# EAGLE design norns-shield-CS4271 (EAGLE 9.6.2)

## Sheet 1 of 2
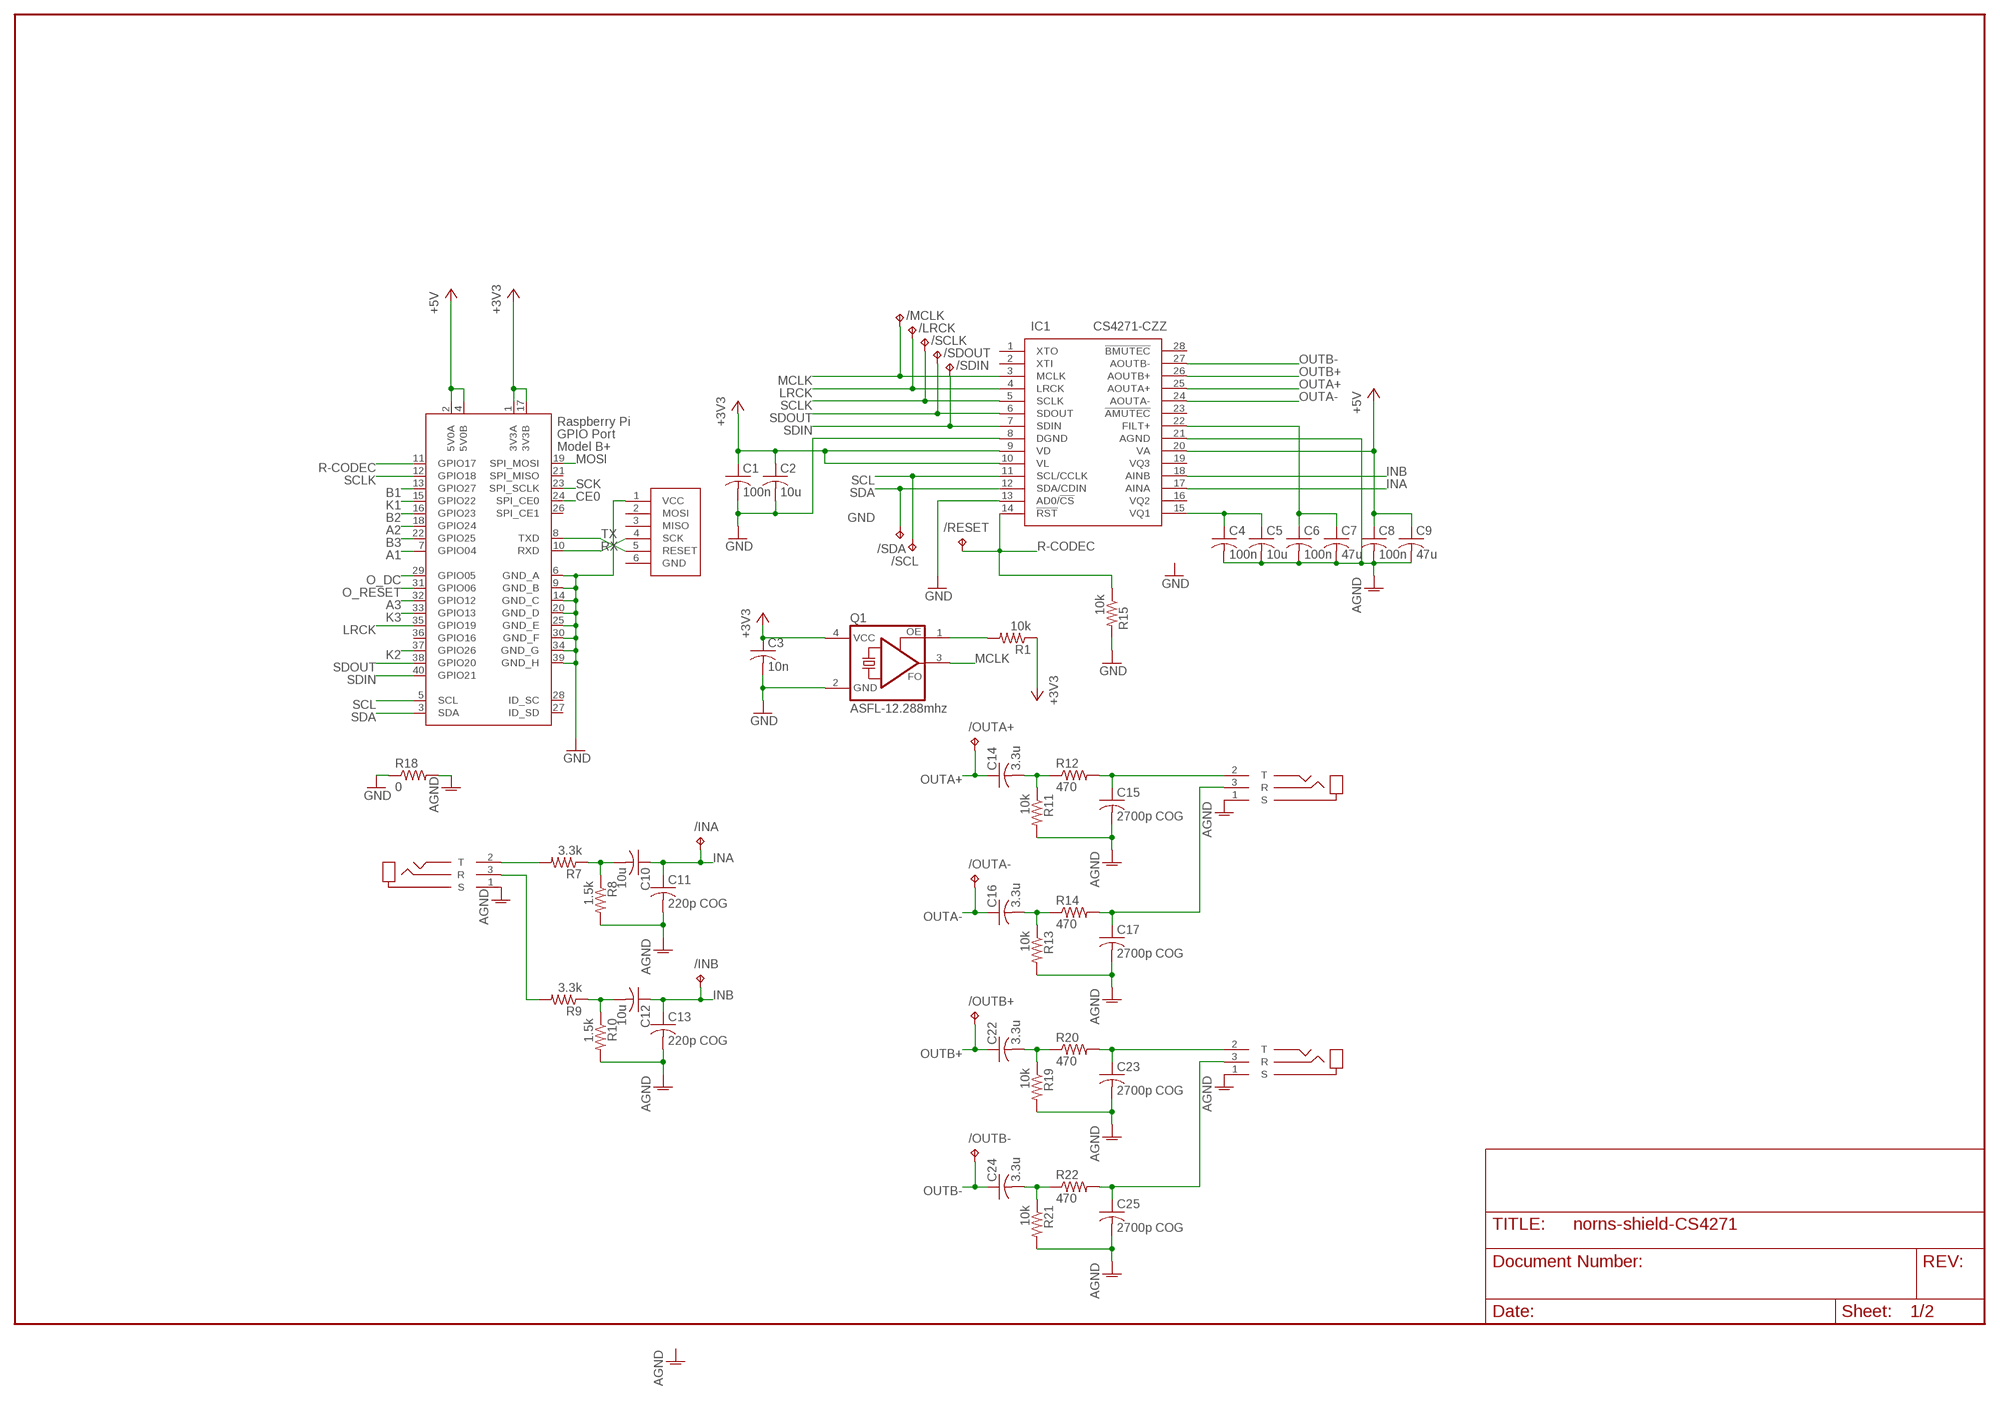
[diagram p0: schematic, sheet 1]

### Parts
/INA  TPTP12R  [TP12R]
/INB  TPTP12R  [TP12R]
/LRCK  TPTP12R  [TP12R]
/MCLK  TPTP12R  [TP12R]
/OUTA+  TPTP12R  [TP12R]
/OUTA-  TPTP12R  [TP12R]
/OUTB+  TPTP12R  [TP12R]
/OUTB-  TPTP12R  [TP12R]
/RESET  TPTP12R  [TP12R]
/SCL  TPTP12R  [TP12R]
/SCLK  TPTP12R  [TP12R]
/SDA  TPTP12R  [TP12R]
/SDIN  TPTP12R  [TP12R]
/SDOUT  TPTP12R  [TP12R]
C1  100n  C-USC0603  [C0603]
C2  10u  C-USC0805  [C0805]
C3  10n  C-USC0603  [C0603]
C4  100n  C-USC0603  [C0603]
C5  10u  C-USC0805  [C0805]
C6  100n  C-USC0603  [C0603]
C7  47u  C-USC1206  [C1206]
C8  100n  C-USC0603  [C0603]
C9  47u  C-USC1206  [C1206]
C10  10u  C-USC0805  [C0805]
C11  220p COG  C-USC0603  [C0603]
C12  10u  C-USC0805  [C0805]
C13  220p COG  C-USC0603  [C0603]
C14  3.3u  C-USC0805  [C0805]
C15  2700p COG  C-USC0603  [C0603]
C16  3.3u  C-USC0805  [C0805]
C17  2700p COG  C-USC0603  [C0603]
C22  3.3u  C-USC0805  [C0805]
C23  2700p COG  C-USC0603  [C0603]
C24  3.3u  C-USC0805  [C0805]
C25  2700p COG  C-USC0603  [C0603]
IC1  CS4271-CZZ  [SOP65P640X120-28N]
J1  TRS-IN  JACK-TRS  [SJ-3523-SMT]
J2  TRS-OUT  JACK-TRS  [SJ-3523-SMT]
J3  ISP-ROW  [ISP-ROW]
J5  TRS-OUT  JACK-TRS  [SJ-3523-SMT]
Q1  ASFL-12.288mhz  ASFL  [ASF]
R1  10k  R-US_R0603  [R0603]
R7  3.3k  R-US_R0603  [R0603]
R8  1.5k  R-US_R0603  [R0603]
R9  3.3k  R-US_R0603  [R0603]
R10  1.5k  R-US_R0603  [R0603]
R11  10k  R-US_R0603  [R0603]
R12  470  R-US_R0603  [R0603]
R13  10k  R-US_R0603  [R0603]
R14  470  R-US_R0603  [R0603]
R15  10k  R-US_R0603  [R0603]
R18  0  R-US_R0603  [R0603]
R19  10k  R-US_R0603  [R0603]
R20  470  R-US_R0603  [R0603]
R21  10k  R-US_R0603  [R0603]
R22  470  R-US_R0603  [R0603]
X1  RASPI_BOARD_B+#_E3  [RASPI_BOARD_B+_EDGES_3DRILL]

### Nets
+3V3: C1.1 C2.1 C3.1 IC1.9(VD) IC1.10(VL) Q1.4(VCC) R1.1 X1.1(3V3A) X1.17(3V3B) ; also sheet 2
+5V: C8.1 C9.1 IC1.20(VA) X1.2(5V0A) X1.4(5V0B)
A1: X1.7(GPIO04) ; also sheet 2
A2: X1.18(GPIO24) ; also sheet 2
A3: X1.32(GPIO12) ; also sheet 2
AGND: C4.2 C5.2 C6.2 C7.2 C8.2 C9.2 C11.2 C13.2 C15.2 C17.2 C23.2 C25.2 IC1.21(AGND) J1.1(S) J2.1(S) J5.1(S) R8.2 R10.2 R11.2 R13.2 R18.2 R19.2 R21.2
B1: X1.13(GPIO27) ; also sheet 2
B2: X1.16(GPIO23) ; also sheet 2
B3: X1.22(GPIO25) ; also sheet 2
CE0: X1.24(SPI_CE0) ; also sheet 2
FILT+: C6.1 C7.1 IC1.22(FILT+)
GND: C1.2 C2.2 C3.2 IC1.8(DGND) IC1.13(AD0/!CS) J3.1(VCC) Q1.2(GND) R15.2 R18.1 X1.6(GND_A) X1.9(GND_B) X1.14(GND_C) X1.20(GND_D) X1.25(GND_E) X1.30(GND_F) X1.34(GND_G) X1.39(GND_H) ; also sheet 2
INA: /INA.TP C10.1 C11.1 IC1.17(AINA)
INB: /INB.TP C12.1 C13.1 IC1.18(AINB)
K1: X1.15(GPIO22) ; also sheet 2
K2: X1.37(GPIO26) ; also sheet 2
K3: X1.33(GPIO13) ; also sheet 2
LRCK: /LRCK.TP IC1.4(LRCK) X1.35(GPIO19)
MCLK: /MCLK.TP IC1.3(MCLK) Q1.3(FO)
MOSI: X1.19(SPI_MOSI) ; also sheet 2
N$1: Q1.1(OE) R1.2
N$9: C10.2 R7.1 R8.1
N$10: C12.2 R9.1 R10.1
N$11: J1.2(T) R7.2
N$12: J1.3(R) R9.2
N$13: C16.2 R13.1 R14.1
N$14: C14.2 R11.1 R12.1
N$17: C22.2 R19.1 R20.1
N$21: C24.2 R21.1 R22.1
O_DC: X1.29(GPIO05) ; also sheet 2
O_RESET: X1.31(GPIO06) ; also sheet 2
OUTA+: /OUTA+.TP C14.1 IC1.25(AOUTA+)
OUTA+2: C15.1 J2.2(T) R12.2
OUTA-: /OUTA-.TP C16.1 IC1.24(AOUTA-)
OUTA-2: C17.1 J2.3(R) R14.2
OUTB+: /OUTB+.TP C22.1 IC1.26(AOUTB+)
OUTB+2: C23.1 J5.2(T) R20.2
OUTB-: /OUTB-.TP C24.1 IC1.27(AOUTB-)
OUTB-2: C25.1 J5.3(R) R22.2
R-CODEC: /RESET.TP IC1.14(!RST) R15.1 X1.11(GPIO17)
RX: J3.4(SCK) X1.10(RXD)
SCK: X1.23(SPI_SCLK) ; also sheet 2
SCL: /SCL.TP IC1.11(SCL/CCLK) X1.5(SCL)
SCLK: /SCLK.TP IC1.5(SCLK) X1.12(GPIO18)
SDA: /SDA.TP IC1.12(SDA/CDIN) X1.3(SDA)
SDIN: /SDIN.TP IC1.7(SDIN) X1.40(GPIO21)
SDOUT: /SDOUT.TP IC1.6(SDOUT) X1.38(GPIO20)
TX: J3.5(RESET) X1.8(TXD)
VQ1: C4.1 C5.1 IC1.15(VQ1)
Unconnected: IC1.1(XTO) IC1.2(XTI) IC1.16(VQ2) IC1.19(VQ3) IC1.23(!AMUTEC) IC1.28(!BMUTEC) J3.2(MOSI) J3.3(MISO) J3.6(GND) X1.21(SPI_MISO) X1.26(SPI_CE1) X1.27(ID_SD) X1.28(ID_SC) X1.36(GPIO16)

## Sheet 2 of 2
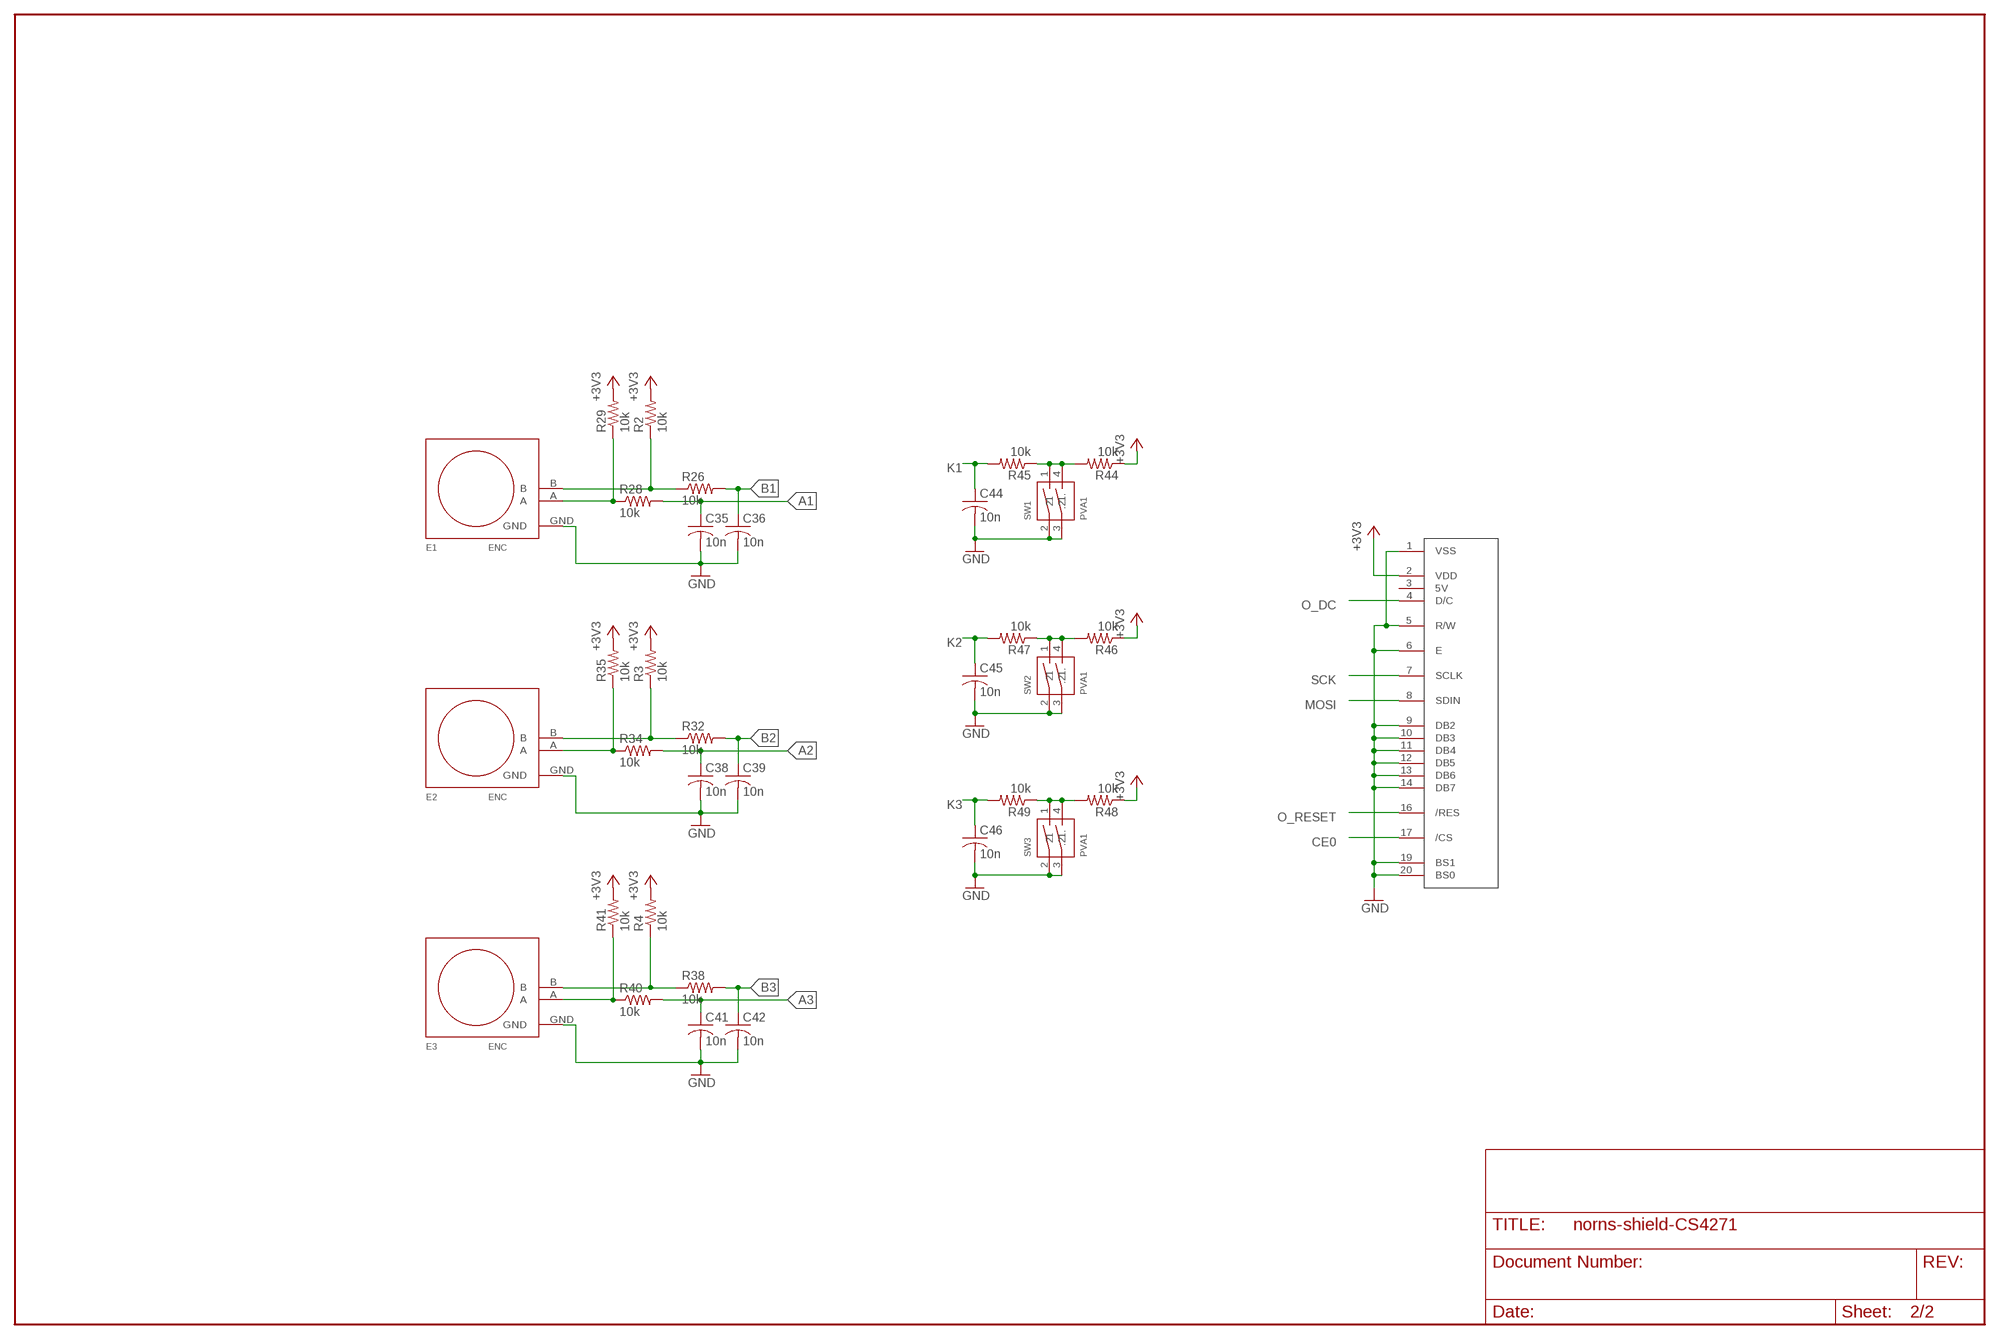
[diagram p1: schematic, sheet 2]

### Parts
C35  10n  C-USC0603  [C0603]
C36  10n  C-USC0603  [C0603]
C38  10n  C-USC0603  [C0603]
C39  10n  C-USC0603  [C0603]
C41  10n  C-USC0603  [C0603]
C42  10n  C-USC0603  [C0603]
C44  10n  C-USC0603  [C0603]
C45  10n  C-USC0603  [C0603]
C46  10n  C-USC0603  [C0603]
E1  ENC  [PEC11RN]
E2  ENC  [PEC11RN]
E3  ENC  [PEC11RN]
R2  10k  R-US_R0603  [R0603]
R3  10k  R-US_R0603  [R0603]
R4  10k  R-US_R0603  [R0603]
R26  10k  R-US_R0603  [R0603]
R28  10k  R-US_R0603  [R0603]
R29  10k  R-US_R0603  [R0603]
R32  10k  R-US_R0603  [R0603]
R34  10k  R-US_R0603  [R0603]
R35  10k  R-US_R0603  [R0603]
R38  10k  R-US_R0603  [R0603]
R40  10k  R-US_R0603  [R0603]
R41  10k  R-US_R0603  [R0603]
R44  10k  R-US_R0603  [R0603]
R45  10k  R-US_R0603  [R0603]
R46  10k  R-US_R0603  [R0603]
R47  10k  R-US_R0603  [R0603]
R48  10k  R-US_R0603  [R0603]
R49  10k  R-US_R0603  [R0603]
SW1  PVA1  [PVA1]
SW2  PVA1  [PVA1]
SW3  PVA1  [PVA1]
U$1  OLED128X64  [OLED-ALEPH]

### Nets
+3V3: R2.2 R3.2 R4.2 R29.2 R35.2 R41.2 R44.1 R46.1 R48.1 U$1.2(VDD) ; also sheet 1
A1: C35.1 R28.2 ; also sheet 1
A2: C38.1 R34.2 ; also sheet 1
A3: C41.1 R40.2 ; also sheet 1
B1: C36.1 R26.2 ; also sheet 1
B2: C39.1 R32.2 ; also sheet 1
B3: C42.1 R38.2 ; also sheet 1
CE0: U$1.17(/CS) ; also sheet 1
GND: C35.2 C36.2 C38.2 C39.2 C41.2 C42.2 C44.2 C45.2 C46.2 E1.GND E2.GND E3.GND SW1.2 SW1.3(1.) SW2.2 SW2.3(1.) SW3.2 SW3.3(1.) U$1.1(VSS) U$1.5(R/W) U$1.6(E) U$1.9(DB2) U$1.10(DB3) U$1.11(DB4) U$1.12(DB5) U$1.13(DB6) U$1.14(DB7) U$1.19(BS1) U$1.20(BS0) ; also sheet 1
K1: C44.1 R45.2 ; also sheet 1
K2: C45.1 R47.2 ; also sheet 1
K3: C46.1 R49.2 ; also sheet 1
MOSI: U$1.8(SDIN) ; also sheet 1
N$2: R44.2 R45.1 SW1.1 SW1.4(.2)
N$3: R46.2 R47.1 SW2.1 SW2.4(.2)
N$6: R48.2 R49.1 SW3.1 SW3.4(.2)
N$18: E1.A R28.1 R29.1
N$19: E1.B R2.1 R26.1
N$22: E2.B R3.1 R32.1
N$25: E2.A R34.1 R35.1
N$27: E3.B R4.1 R38.1
N$28: E3.A R40.1 R41.1
O_DC: U$1.4(D/C) ; also sheet 1
O_RESET: U$1.16(/RES) ; also sheet 1
SCK: U$1.7(SCLK) ; also sheet 1
Unconnected: U$1.3(5V)

## Library data of the parts
/INA /INB /LRCK /MCLK /OUTA+ /OUTA- /OUTB+ /OUTB- /RESET /SCL /SCLK /SDA /SDIN /SDOUT = testpad:TP: Test pad
C1-C17 C22-C25 C35 C36 C38 C39 C41 C42 C44-C46 = rcl:C-US: CAPACITOR, American symbol
E1-E3 = lines:ENC
IC1 = SamacSys_Parts:CS4271-CZZ: IC CODEC AUD 24BIT 114DB 28TSSOP Source: Datasheet <https://d3uzseaevmutz1.cloudfront.net/pubs/proDatasheet/CS4271_F1.pdf>; DESCRIPTION: IC CODEC AUD 24BIT 114DB 28TSSOP; HEIGHT: 1.2mm; MANUFACTURER_NAME: Cirrus Logic; MANUFACTURER_PART_NUMBER: CS4271-CZZ; MOUSER_PART_NUMBER: 777-CS4271-CZZ; MOUSER_PRICE-STOCK: https://www.mouser.co.uk/ProductDetail/Cirrus-Logic/CS4271-CZZ?qs=bUPhaerQQeHKUGJm56VfAA%3D%3D
J1 J2 J5 = lines:JACK-TRS
J3 = monome-inc:ISP-ROW
Q1 = crystal:ASF*: CRYSTAL CLOCK OSCILLATORS 5.0 Vdc or 3.3 Vdc - LOW PROFILE ULTRA MINIATURE CERAMIC SURFACE MOUNT Source: http://www.abracon.com/Oscillators/asf1-L-L1.pdf; MPN: ASFLM1-50.000MHZ-C-T; OC_FARNELL: 1838931; OC_NEWARK: 99M0411
R1-R4 R7-R15 R18-R22 R26 R28 R29 R32 R34 R35 R38 R40 R41 R44-R49 = rcl:R-US_: RESISTOR, American symbol
SW1-SW3 = monome-inc:PVA1
U$1 = monome_modular:OLED128X64
X1 = raspberrypi_bastelstube_v13:RASPI_BOARD_B+#: Raspberry Pi GPIO connector with markings for the outer dimensions of the Raspberry Pi board model B+ with different sets of drill holes or mounting pads All pins connected

## Board
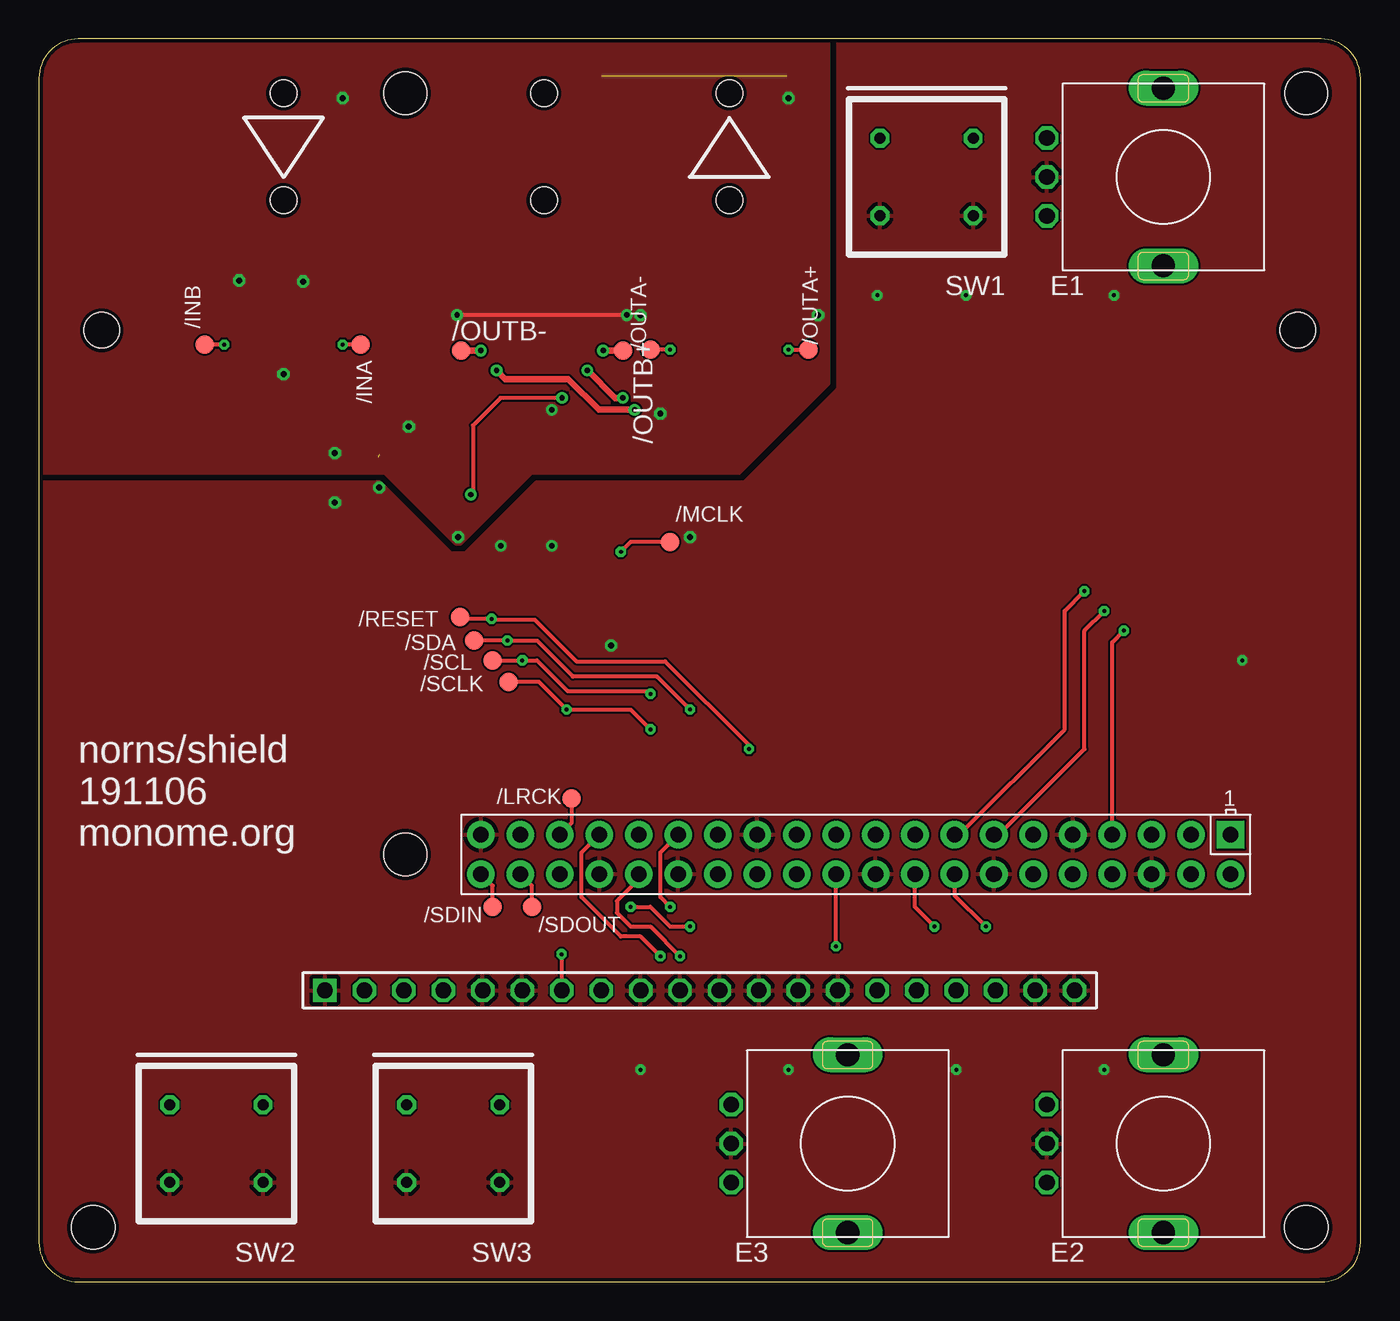
[diagram p2: board, top side]
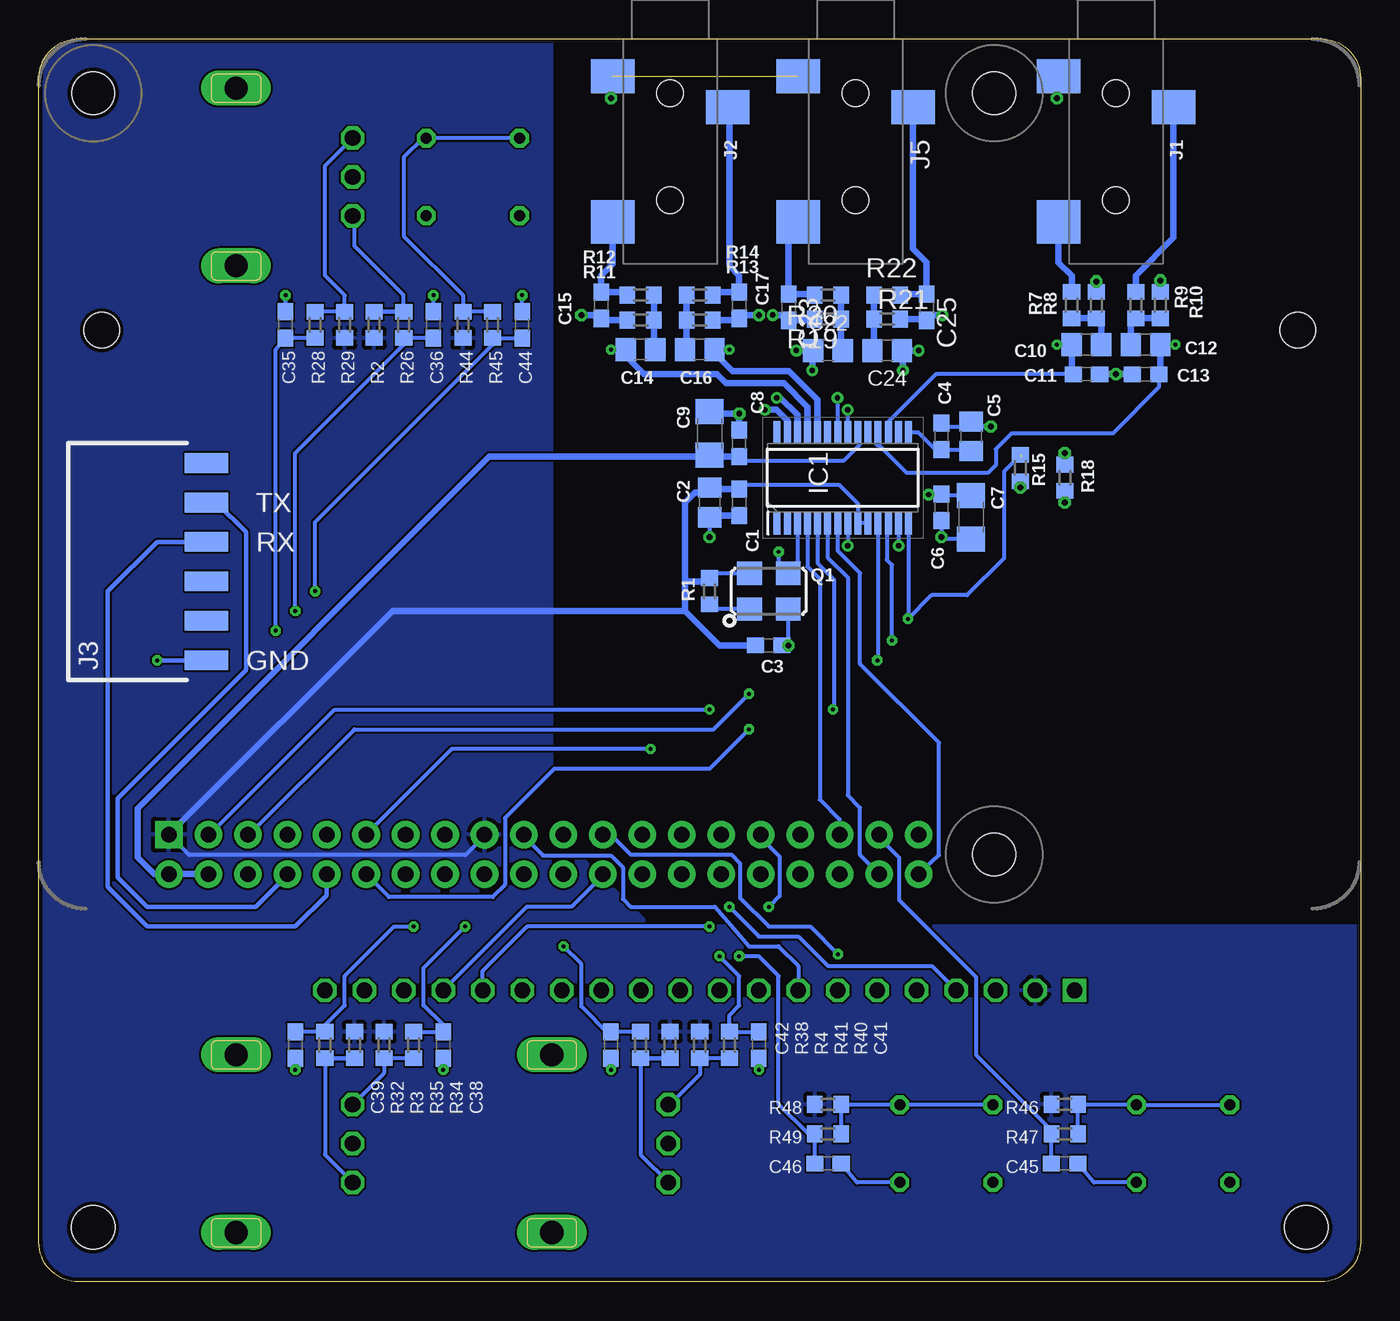
[diagram p3: board, bottom side, seen from below]

Size 85.09 x 80.01 mm. Coordinates in mm from the lower left corner, seen from the top.
Outline: 0,77.47 0,2.54 arc90 2.54,0 82.55,0 arc90 85.09,2.54 85.09,77.47 arc90 82.55,80.01 2.54,80.01 arc90 0,77.47
Copper layers (1*16): Top 0.035mm / dielectric 1.5mm / Bottom 0.035mm
Design rules "default *": minimum track width 8mil, minimum drill 10mil, track to track 5mil, track to pad 5mil, pad to pad 5mil, via to via 5mil, smd to smd 0mil, copper to edge 10mil, drill to drill 8mil, minimum pad ring 10mil, minimum via ring 8mil, stop-mask expansion 4mil, vias tented up to drill 0mil, thermal gap 10mil
Holes 2.8 mm at 81.6,3.49 3.49,3.49

### Footprints (pad centres in the part's own frame; a part is rotated, then mirrored left to right if it is on the bottom)
TP12R = smd 1.2 x 1.2: TP 0,0
C0603 = smd 1.1 x 1: 1 -0.85,0; 2 0.85,0
C0805 = smd 1.3 x 1.5: 1 -0.95,0; 2 0.95,0
C1206 = smd 1.6 x 1.8: 1 -1.4,0; 2 1.4,0
PEC11RN = drill 1 octagon: A -2.5,-7.5; B 2.5,-7.5; GND 0,-7.5 | drill 1.5 long: P$1 -5.715,0; P$2 5.715,0
SOP65P640X120-28N = smd 1.45 x 0.45: 1 -2.925,4.225; 2 -2.925,3.575; 3 -2.925,2.925; 4 -2.925,2.275; 5 -2.925,1.625; 6 -2.925,0.975; 7 -2.925,0.325; 8 -2.925,-0.325; 9 -2.925,-0.975; 10 -2.925,-1.625; 11 -2.925,-2.275; 12 -2.925,-2.925; 13 -2.925,-3.575; 14 -2.925,-4.225; 15 2.925,-4.225; 16 2.925,-3.575; 17 2.925,-2.925; 18 2.925,-2.275; 19 2.925,-1.625; 20 2.925,-0.975; 21 2.925,-0.325; 22 2.925,0.325; 23 2.925,0.975; 24 2.925,1.625; 25 2.925,2.275; 26 2.925,2.925; 27 2.925,3.575; 28 2.925,4.225
SJ-3523-SMT = smd 2.2 x 2.8: 1 2.4,-3.7; 3 4.4,3.7 | smd 2.8 x 2.8: 2 11.8,-3.7 | hole 1.7: 3.5,0; 3.5,0; 10.4,0
ISP-ROW = smd 1.27 x 2.794: 1 -6.35,0; 2 -3.81,0; 3 -1.27,0; 4 1.27,0; 5 3.81,0; 6 6.35,0
ASF = smd 1.6 x 1.5: 1 -1.25,-1.15; 2 1.25,-1.15; 3 1.25,1.15; 4 -1.25,1.15
R0603 = smd 1 x 1.1: 1 -0.85,0; 2 0.85,0
PVA1 = drill 0.7 octagon: 1 -3,-2.5; 2 -3,2.5; 3 3,2.5; 4 3,-2.5
OLED-ALEPH = drill 1 pad 1.5 square: 1 24.13,21.25 | drill 1 pad 1.5 octagon: 2 21.59,21.25; 3 19.05,21.25; 4 16.51,21.25; 5 13.97,21.25; 6 11.43,21.25; 7 8.89,21.25; 8 6.35,21.25; 9 3.81,21.25; 10 1.27,21.25; 11 -1.27,21.25; 12 -3.81,21.25; 13 -6.35,21.25; 14 -8.89,21.25; 15 -11.43,21.25; 16 -13.97,21.25; 17 -16.51,21.25; 18 -19.05,21.25; 19 -21.59,21.25; 20 -24.13,21.25 | hole 2.286: 38.5,-21.25; -38.5,-21.25
RASPI_BOARD_B+_EDGES_3DRILL = drill 1 pad 1.778 square: 1 8.37,51.23 | drill 1 pad 1.778: 2 8.37,53.77; 3 10.91,51.23; 4 10.91,53.77; 5 13.45,51.23; 6 13.45,53.77; 7 15.99,51.23; 8 15.99,53.77; 9 18.53,51.23; 10 18.53,53.77; 11 21.07,51.23; 12 21.07,53.77; 13 23.61,51.23; 14 23.61,53.77; 15 26.15,51.23; 16 26.15,53.77; 17 28.69,51.23; 18 28.69,53.77; 19 31.23,51.23; 20 31.23,53.77; 21 33.77,51.23; 22 33.77,53.77; 23 36.31,51.23; 24 36.31,53.77; 25 38.85,51.23; 26 38.85,53.77; 27 41.39,51.23; 28 41.39,53.77; 29 43.93,51.23; 30 43.93,53.77; 31 46.47,51.23; 32 46.47,53.77; 33 49.01,51.23; 34 49.01,53.77; 35 51.55,51.23; 36 51.55,53.77; 37 54.09,51.23; 38 54.09,53.77; 39 56.63,51.23; 40 56.63,53.77 | hole 2.75: 3.5,3.5; 61.5,3.5; 61.5,52.5

### Placement (x,y rotation side)
/INA  20.7,60.33 90 top
/INB  10.67,60.33 90 top
/LRCK  34.29,31.11 180 top
/MCLK  40.64,47.62 180 top
/OUTA+  49.53,60.01 90 top
/OUTA-  39.37,60.01 90 top
/OUTB+  37.59,59.94 270 top
/OUTB-  27.18,59.94 0 top
/RESET  27.11,42.8 0 top
/SCL  29.21,40 270 top
/SCLK  30.23,38.61 270 top
/SDA  28,41.27 270 top
/SDIN  29.21,24.13 180 top
/SDOUT  31.75,24.13 180 top
C1  40.01,50.16 270 bottom
C2  41.91,50.16 270 bottom
C3  38.1,40.96 0 bottom
C4  26.99,54.42 90 bottom
C5  25.08,54.42 90 bottom
C6  26.99,49.85 270 bottom
C7  25.08,49.21 270 bottom
C8  40.01,53.97 90 bottom
C9  41.91,54.61 90 bottom
C10  17.65,60.33 0 bottom
C11  17.65,58.42 0 bottom
C12  13.84,60.33 180 bottom
C13  13.84,58.42 180 bottom
C14  46.35,60.01 0 bottom
C15  48.9,62.86 270 bottom
C16  42.55,60.01 180 bottom
C17  40.01,62.86 270 bottom
C22  34.29,59.94 0 bottom
C23  36.83,62.74 270 bottom
C24  30.48,59.94 180 bottom
C25  27.94,62.74 270 bottom
C35  69.22,61.59 90 bottom
C36  59.69,61.59 90 bottom
C38  59.05,15.24 270 bottom
C39  68.58,15.24 270 bottom
C41  38.73,15.24 270 bottom
C42  48.26,15.24 270 bottom
C44  53.98,61.59 90 bottom
C45  19.05,7.62 0 bottom
C46  34.29,7.62 0 bottom
E1  72.39,71.12 270 top
E2  72.39,8.89 270 top
E3  52.07,8.89 270 top
IC1  33.34,51.75 90 bottom
J1  15.75,80.01 270 bottom
J2  44.45,80.01 270 bottom
J3  74.3,46.36 90 bottom
J5  32.51,80.01 270 bottom
Q1  38.1,44.45 0 bottom
R1  41.91,44.45 270 bottom
R2  63.5,61.59 270 bottom
R3  64.77,15.24 90 bottom
R4  44.45,15.24 90 bottom
R7  18.61,62.86 90 bottom
R8  17.02,62.86 90 bottom
R9  14.48,62.86 90 bottom
R10  12.89,62.86 90 bottom
R11  46.35,61.91 180 bottom
R12  46.35,63.5 180 bottom
R13  42.55,61.91 0 bottom
R14  42.55,63.5 0 bottom
R15  21.91,52.39 270 bottom
R18  19.05,51.75 90 bottom
R19  34.29,61.98 180 bottom
R20  34.29,63.5 180 bottom
R21  30.48,61.98 0 bottom
R22  30.48,63.5 0 bottom
R26  61.59,61.59 270 bottom
R28  67.31,61.59 270 bottom
R29  65.41,61.59 270 bottom
R32  66.67,15.24 90 bottom
R34  60.96,15.24 90 bottom
R35  62.87,15.24 90 bottom
R38  46.35,15.24 90 bottom
R40  40.64,15.24 90 bottom
R41  42.55,15.24 90 bottom
R44  57.78,61.59 90 bottom
R45  55.88,61.59 270 bottom
R46  19.05,11.43 0 bottom
R47  19.05,9.52 180 bottom
R48  34.29,11.43 0 bottom
R49  34.29,9.52 180 bottom
SW1  57.15,71.12 180 top
SW2  11.43,8.89 180 top
SW3  26.67,8.89 180 top
U$1  42.55,40 180 top
X1  85.09,80.01 180 top

### Tracks (layer width: path | path; a pad name or v marks a point on that pad's centre or on a via)
+3V3
  Bottom 0.254: 41.81,51.02 C2.1 | C1.1 39.57,51.31 33.59,51.31 32.36,50.08 IC1.9 IC1.10 | 41.75,50.96 C2.1 | Q1.4 41.41,45.6 R1.1 41.91,45.08 | 42.23,50.8 C2.1 | X1.1 75.4,27.46 57.63,27.46 56.4,28.69 X1.17
  Bottom 0.406: C1.1 41.7,51.02 41.75,50.96 | C3.1 41.27,40.96 43.5,43.18 | 43.5,43.18 43.5,45.08 | 43.5,45.08 43.5,50.16 42.86,50.8 42.23,50.8 | 41.91,45.08 43.5,45.08 | 43.5,43.18 62.32,43.18 X1.1
  pour Bottom: 0,22.86 45.72,22.86 52.07,29.21 52.07,80.01 85.09,80.01 85.09,0 0,0
+5V
  Bottom 0.254: 41.91,53.12 C9.1 41.84,53.27 | IC1.20 32.28,54.59 32.28,53.85 33.26,52.87 39.75,52.87 C8.1
  Bottom 0.406: C8.1 41.7,53.12 41.84,53.27 | 41.91,53.12 56.09,53.12 78.74,30.48 78.74,27.3 77.67,26.24 X1.2 X1.4
A1  (via drill 0.25)
  Top 0.254: X1.7 69.1,41.16 v69.85,41.91
  Bottom 0.254: R28.2 C35.1 69.85,59.99 v69.85,41.91
A2  (via drill 0.25)
  Top 0.254: v57.66,22.86 56.39,24.13 56.39,26.23 X1.18
  Bottom 0.254: R34.2 C38.1 59.04,16.52 60.33,17.78 60.33,20.19 v57.66,22.86
A3  (via drill 0.25)
  Top 0.254: X1.32 38.62,25.92 37.21,24.51 37.21,23.75 38.1,22.86 39.37,22.86 v41.27,20.95
  Bottom 0.254: C41.1 R40.2 40.64,17.14 40.01,17.78 40.01,19.68 v41.27,20.95
AGND  (via drill 0.35, 0.38)  (1 unrouted)
  Top 0.254: v37.85,62.23 v26.92,62.23
  Bottom 0.254: C4.2 26.77,55.05 25.4,55.05 C5.2 24.77,55.05 v23.81,55.05 | C6.2 v26.99,47.94 26.86,47.81 C7.2 | 41.91,55.88 C9.2 | IC1.21 v33.01,56.13 v33.02,56.13 | C23.2 37,61.89 37.34,62.23 | 27.6,62.23 C25.2
  Bottom 0.406: C8.2 v40.01,55.88 41.91,55.88 | R8.2 v17.02,64.39 | R10.2 v12.89,64.45 | J1.1 19.45,77.58 19.56,77.47 v19.56,76.2 | J2.1 48.15,77.58 48.26,77.47 v48.26,76.2 | C11.2 v15.75,58.42 C13.2 | R18.2 v19.05,53.34 | R13.2 40.11,61.91 C17.2 39.79,62.23 v38.73,62.23 | R11.2 48.79,61.91 C15.2 49.11,62.23 v50.16,62.23 | C25.2 28.03,61.98 R21.2 | R19.2 35.23,61.89 C23.2 | v26.92,62.23 27.6,62.23 | v37.85,62.23 37.34,62.23
  pour Top: 50.8,80.01 50.8,57.78 45.09,52.07 31.69,52.07 27.11,47.5 26.86,47.5 22.29,52.07 0,52.07 0,80.01
B1  (via drill 0.25)
  Top 0.254: X1.13 61.8,28.78 67.31,34.29 67.31,41.91 v68.58,43.18
  Bottom 0.254: C36.1 R26.2 61.59,60.33 68.58,53.34 v68.58,43.18
B2  (via drill 0.25)
  Top 0.254: v60.96,22.86 58.94,24.88 X1.16
  Bottom 0.254: C39.1 R32.2 66.66,16.52 65.41,17.78 65.41,19.68 62.23,22.86 v60.96,22.86
B3  (via drill 0.25)
  Top 0.254: v51.31,21.59 51.31,26.23 X1.22
  Bottom 0.254: R38.2 C42.1 48.34,15.89 50.16,17.72 50.16,20.45 v51.31,21.59
CE0
  Bottom 0.254: X1.24 48.78,26.15 50.8,24.13 53.68,24.13 U$1.17
FILT+  (via drill 0.35)
  Top 0.254: v27.81,50.67 27.94,50.8 27.94,55.12 29.72,56.9 v33.68,56.9
  Bottom 0.254: C7.1 26.9,50.61 C6.1 27.01,50.67 v27.81,50.67 | IC1.22 33.66,56.88 v33.68,56.9
GND  (via drill 0.25, 0.35, 0.38)
  Bottom 0.254: C2.2 v41.91,47.94 | v21.91,51.12 R15.2 22.21,51.74 | C3.2 v36.83,40.96 36.83,43.28 Q1.2 | C36.2 v59.69,63.5 | C35.2 v69.22,63.5 | C41.2 v38.73,13.65 | C42.2 v48.26,13.65 | C38.2 v59.05,13.65 | C39.2 v68.58,13.65 | C45.2 17.17,6.39 SW2.2 | C46.2 32.41,6.39 SW3.2 | C44.2 53.96,62.25 v53.98,63.5 | IC1.13 29.76,47.39 v29.75,47.37 | IC1.8 v33.01,47.38 v33.02,47.37
  Bottom 0.305: J3.1 v77.47,40
  Bottom 0.406: R18.1 v19.05,50.16 | C1.2 41.81,49.31 C2.2
  pour Top: 85.09,0 85.09,80.01 51.44,80.01 51.44,57.47 45.4,51.44 32,51.44 27.43,46.86 26.54,46.86 21.97,51.44 0,51.44 0,0
INA  (via drill 0.25)
  Top 0.254: /INA.TP v19.56,60.33
  Bottom 0.254: 18.76,58.67 C11.1 27.33,58.42 30.42,55.33 IC1.17 | C10.1 v19.56,60.33
  Bottom 0.406: C10.1 18.6,58.52 C11.1
INB  (via drill 0.25)
  Top 0.254: v11.94,60.33 /INB.TP
  Bottom 0.254: C13.1 12.99,57.58 15.96,54.61 22.48,54.61 23.5,53.59 23.5,52.58 24,52.07 29.22,52.07 31.06,53.91 | C12.1 v11.94,60.33
  Bottom 0.406: C12.1 12.89,58.52 C13.1 | 31.06,53.91 IC1.18
K1  (via drill 0.25)
  Top 0.254: X1.15 59.26,28.78 66.04,35.56 66.04,43.18 v67.31,44.45
  Bottom 0.254: C44.1 R45.2 55.88,60.33 67.31,48.89 v67.31,44.45
K2
  Bottom 0.254: C45.1 R47.2 20,9.84 24.77,14.6 24.77,19.62 29.72,24.57 29.72,27.3 31,28.59 X1.37
K3  (via drill 0.25)
  Top 0.254: v40.01,20.95 38.73,22.22 37.47,22.22 34.92,24.77 34.92,27.62 X1.33
  Bottom 0.254: C46.1 R49.2 35.56,9.52 37.47,11.43 37.47,19.68 38.73,20.95 v40.01,20.95
LRCK
  Top 0.254: /LRCK.TP 34.29,29.53 X1.35
  Bottom 0.254: IC1.4 35.61,46.03 34.81,45.22 34.81,31.03 33.54,29.76 X1.35
MCLK  (via drill 0.25)
  Top 0.254: /MCLK.TP 38.1,47.62 v37.47,46.99
  Bottom 0.254: 36.18,49.4 36.18,48.91 IC1.3 36.26,46.19 Q1.3 37.47,46.22 v37.47,46.99
MOSI
  Bottom 0.254: X1.19 53.86,28.65 52.64,27.43 48.26,27.43 47.5,26.67 47.5,24.64 46.99,24.13 41.57,24.13 39.37,21.59 37.47,21.59 36.2,20.32 U$1.8
N$1
  Bottom 0.254: Q1.1 41.41,43.3 R1.2
N$2
  Bottom 0.254: SW1.4 SW1.1 60.37,73.62 61.59,72.39 61.59,67.31 57.78,63.5 R44.2 R45.1
N$3
  Bottom 0.254: R47.1 R46.2 14.47,11.43 SW2.1 SW2.4
N$6
  Bottom 0.254: R49.1 R48.2 33.6,11.39 SW3.1 SW3.4
N$9
  Bottom 0.406: R7.1 R8.1 16.7,61.7 C10.2
N$10
  Bottom 0.406: R10.1 R9.1 14.79,61.7 C12.2
N$11
  Bottom 0.406: R7.2 18.61,64.77 19.45,65.61 J1.2
N$12
  Bottom 0.406: J1.3 12.05,67.2 14.48,64.77 R9.2
N$13
  Bottom 0.406: R14.1 R13.1 43.4,60.11 C16.2 43.83,60.34
N$14
  Bottom 0.406: R12.1 R11.1 45.51,60.11 C14.2 45.07,60.34
N$17
  Bottom 0.406: R20.1 R19.1 33.44,60.04 C22.2
N$18
  Bottom 0.254: R28.1 R29.1 65.41,63.5 66.67,64.77 66.67,71.83 E1.A
N$19
  Bottom 0.254: R26.1 61.61,63.52 64.77,66.67 64.77,68.5 E1.B
  Bottom 0.305: R26.1 R2.1
N$21
  Bottom 0.406: R22.1 R21.1 31.33,60.04 C24.2
N$22
  Bottom 0.254: R32.1 66.67,8.17 E2.B
  Bottom 0.305: R3.1 R32.1
N$25
  Bottom 0.254: R34.1 R35.1 62.87,13.41 E2.A
N$27
  Bottom 0.254: R38.1 46.35,8.17 E3.B
  Bottom 0.305: R4.1 R38.1
N$28
  Bottom 0.254: R40.1 R41.1 42.55,13.33 44.45,11.43 44.45,11.51 E3.A
O_DC  (via drill 0.25)
  Top 0.254: v40.64,24.13 40.01,24.77 40.01,27.62 X1.29
  Bottom 0.254: v40.64,24.13 38.73,22.22 36.2,22.22 34.29,20.32 27.6,20.32 U$1.4
O_RESET  (via drill 0.25)
  Top 0.254: v38.1,24.13 39.37,24.13 40.64,22.86 v41.91,22.86
  Bottom 0.254: X1.31 38.62,28.59 37.4,27.37 37.4,24.83 v38.1,24.13 | v41.91,22.86 53.66,22.86 56.52,20 U$1.16
OUTA+  (via drill 0.25)
  Top 0.254: v48.26,60.01 /OUTA+.TP
  Bottom 0.254: C14.1 v48.26,60.01
  Bottom 0.406: C14.1 47.3,59.6 46.12,58.42 41.45,58.42 40.86,57.84 37.13,57.84 35.61,56.31 IC1.25
OUTA+2
  Bottom 0.406: R12.2 47.42,63.72 C15.1 48.9,64.77 48.15,65.52 J2.2
OUTA-  (via drill 0.25)
  Top 0.254: v40.64,60.01 /OUTA-.TP
  Bottom 0.254: C16.1 v40.64,60.01
  Bottom 0.406: C16.1 41.59,59.78 40.44,58.62 36.8,58.62 34.96,56.78 IC1.24
OUTA-2
  Bottom 0.406: J2.3 40.64,75.5 40.64,65.41 40.01,64.77 C17.1 41.48,63.72 R14.2
OUTB+  (via drill 0.35)
  Top 0.406: v36.32,59.94 /OUTB+.TP | v37.59,56.9 37.08,56.9 v35.31,58.67
  Bottom 0.406: v36.32,59.94 C22.1 35.29,59.89 35.29,58.69 v35.31,58.67 | IC1.26 36.26,55.82 37.34,56.9 v37.59,56.9
OUTB+2
  Bottom 0.406: R20.2 35.23,63.59 C23.1 36.83,67.59 J5.2
OUTB-  (via drill 0.35)
  Top 0.406: v28.45,59.94 /OUTB-.TP | v38.35,56.13 36.05,56.13 34.07,58.11 30.02,58.11 v29.46,58.67
  Bottom 0.406: v28.45,59.94 C24.1 29.46,59.88 v29.46,58.67 | IC1.27 36.91,55.44 37.6,56.13 v38.35,56.13
OUTB-2
  Bottom 0.406: J5.3 28.81,66.49 27.94,65.62 C25.1 29.54,63.59 R22.2
R-CODEC  (via drill 0.25)  (1 unrouted)
  Top 0.254: v45.72,34.29 45.72,34.54 40.32,39.94 34.61,39.94 31.94,42.61 29.21,42.61 v29.15,42.67 27.24,42.67 /RESET.TP
  Bottom 0.254: 21.89,53.04 21.84,53.09 | v45.72,34.29 58.51,34.29 X1.11 | IC1.14 29.11,42.71 v29.15,42.67 27.62,44.2 25.34,44.2 22.96,46.57 22.96,52.14 21.91,53.2 R15.1
RX
  Bottom 0.305: X1.10 66.56,24.88 68.58,22.86 78.11,22.86 80.64,25.4 80.64,44.45 77.47,47.62 J3.4
SCK  (via drill 0.25)
  Top 0.254: v33.66,21.08 U$1.7
  Bottom 0.254: X1.23 48.27,28.78 46.99,27.49 40.51,27.49 39.94,26.92 39.94,24.7 38.1,22.86 35.43,22.86 v33.66,21.08
SCL  (via drill 0.25)
  Top 0.254: v39.37,37.85 39.21,38 34.07,38 32.07,40 v31.11,40 /SCL.TP
  Bottom 0.254: v31.11,40 31.06,40.06 IC1.11 | X1.5 71.55,28.78 64.77,35.56 41.66,35.56 v39.37,37.85
SCLK  (via drill 0.25)
  Top 0.254: v39.37,35.56 38.1,36.83 v33.97,36.83 32.19,38.61 /SCLK.TP
  Bottom 0.254: v39.37,35.56 41.91,33.02 51.91,33.02 55.09,29.84 55.09,25.56 55.88,24.77 62.55,24.77 X1.12 | IC1.5 34.96,46.27 33.91,45.21 33.91,36.89 v33.97,36.83
SDA  (via drill 0.25)
  Top 0.254: v41.91,36.83 39.78,38.96 34.38,38.96 32.07,41.27 v30.16,41.27 /SDA.TP
  Bottom 0.254: X1.3 74.09,28.78 66.04,36.83 v41.91,36.83 | v30.16,41.27 30.16,46.14 30.5,46.47 30.5,48.74 IC1.12
SDIN
  Top 0.254: /SDIN.TP 29.21,25.49 X1.40
  Bottom 0.254: X1.40 27.15,27.46 27.15,34.7 32.22,39.78 32.22,45.61 33.66,47.05 IC1.7
SDOUT
  Top 0.254: /SDOUT.TP 31.75,25.49 X1.38
  Bottom 0.254: X1.38 32.23,27.47 32.23,30.51 33.02,31.31 33.02,45.34 34.31,46.63 IC1.6
TX
  Bottom 0.305: X1.8 69.1,26.15 71.12,24.13 78.11,24.13 80.01,26.04 80.01,31.11 71.75,39.37 71.75,48.26 73.66,50.16 J3.5
VQ1
  Bottom 0.254: 27.2,53.78 C4.1 | C4.1 27.37,53.57 28.48,54.68 IC1.15 | C4.1 25.18,53.57 C5.1

### Text on the board
tPlace: norns/shield / 191106 / monome.org
bNames: TX | RX | GND